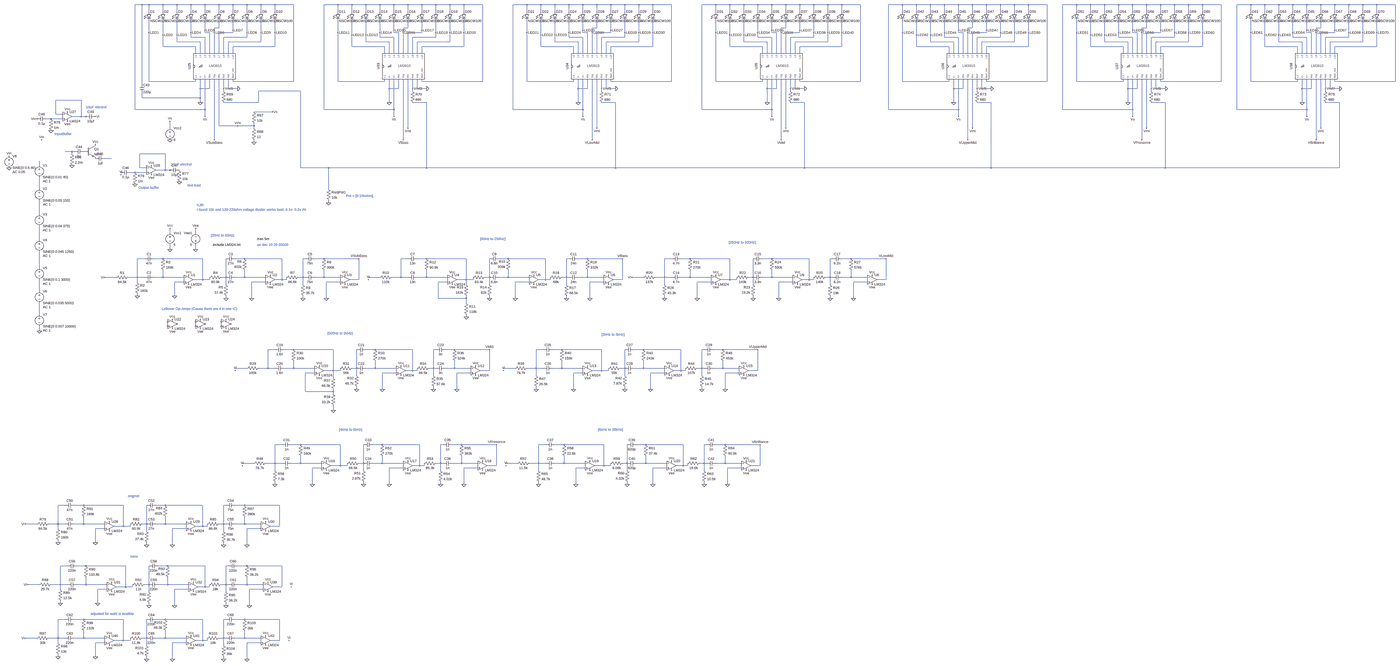
[diagram p0: schematic Full_Visualizer.asc, whole sheet]
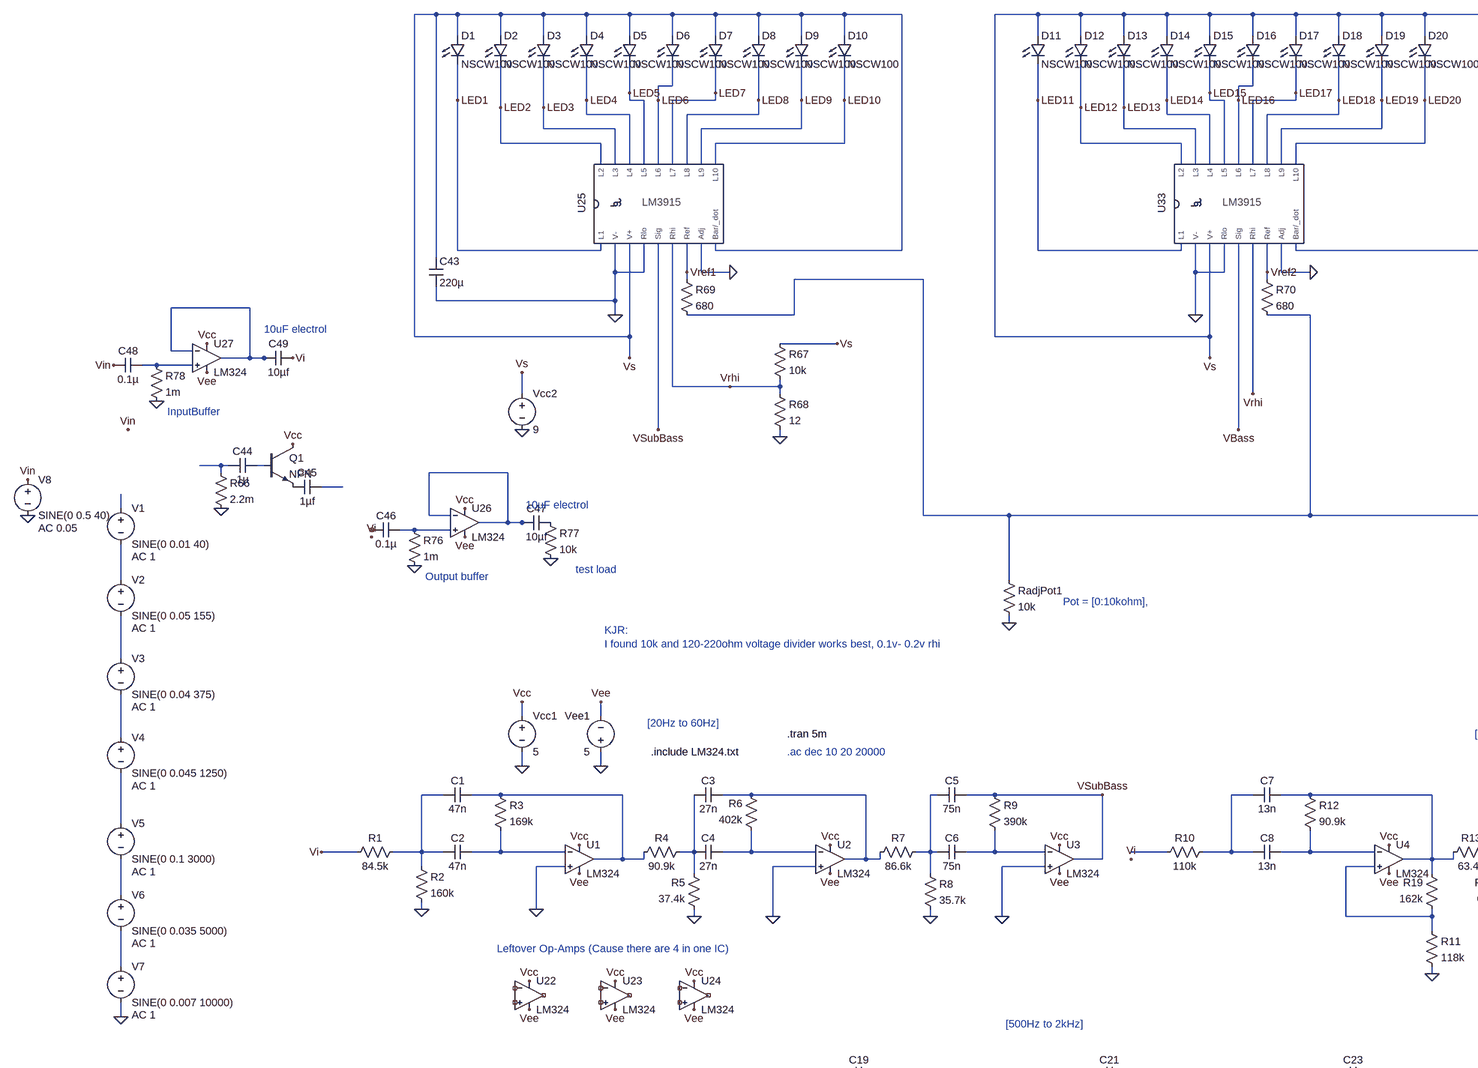
[diagram p1: schematic Full_Visualizer.asc, part, row 1 of 2, column 1 of 3]
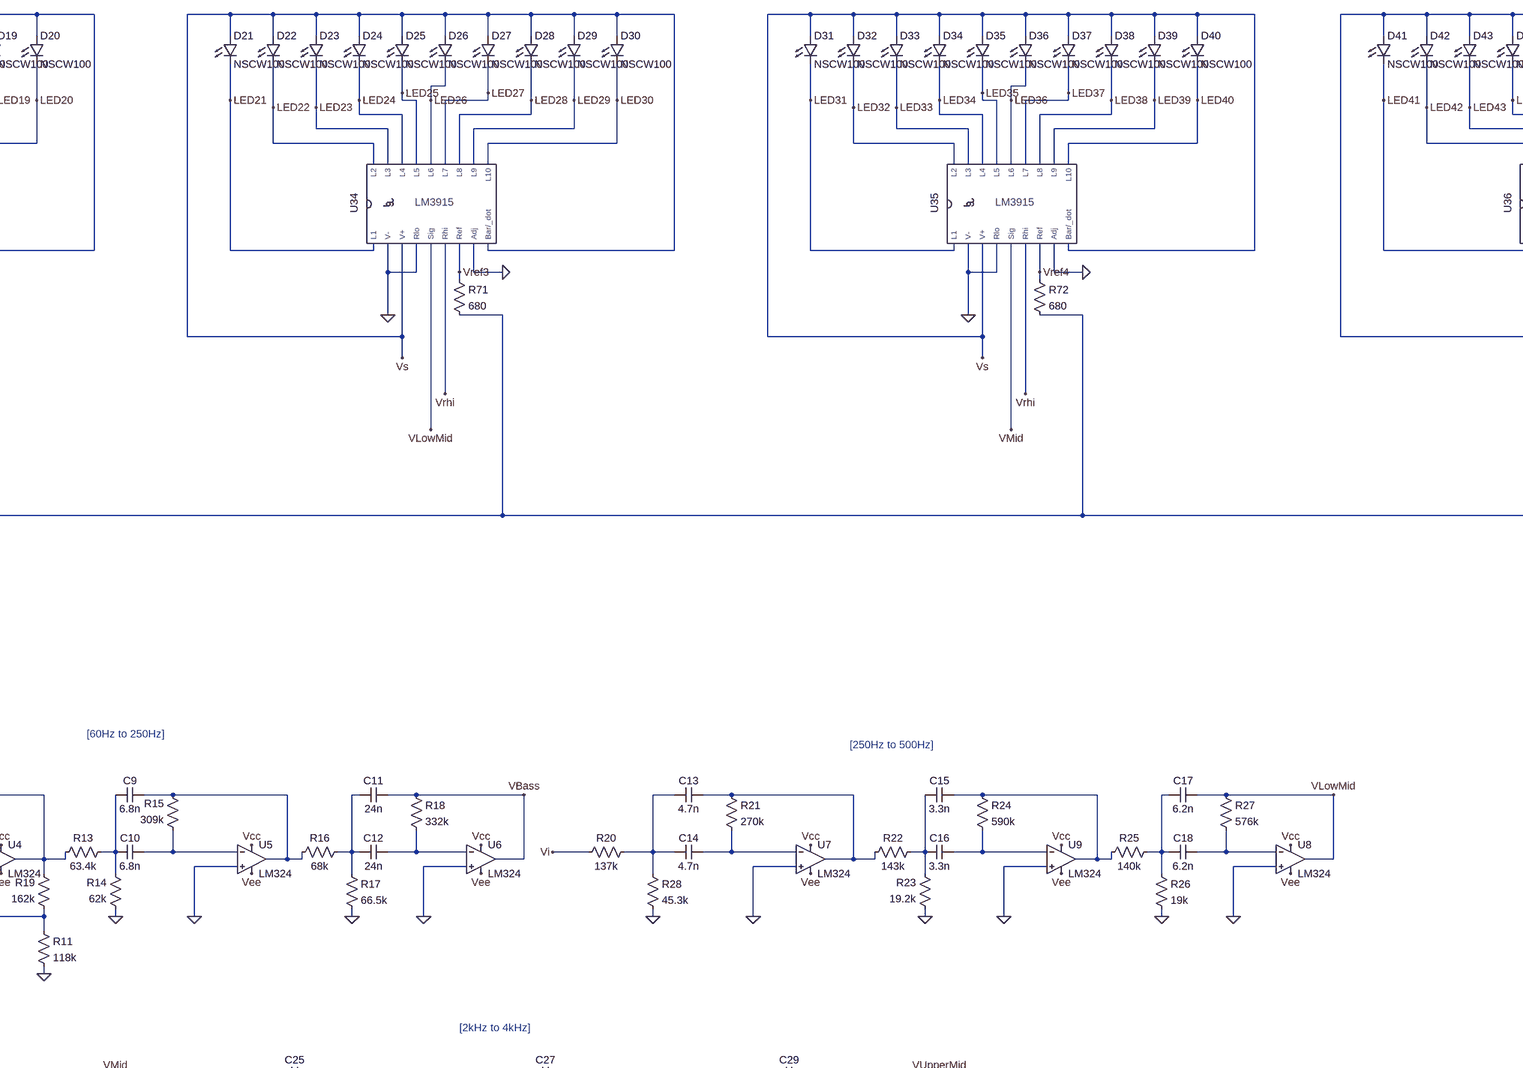
[diagram p2: schematic Full_Visualizer.asc, part, row 1 of 2, column 2 of 3]
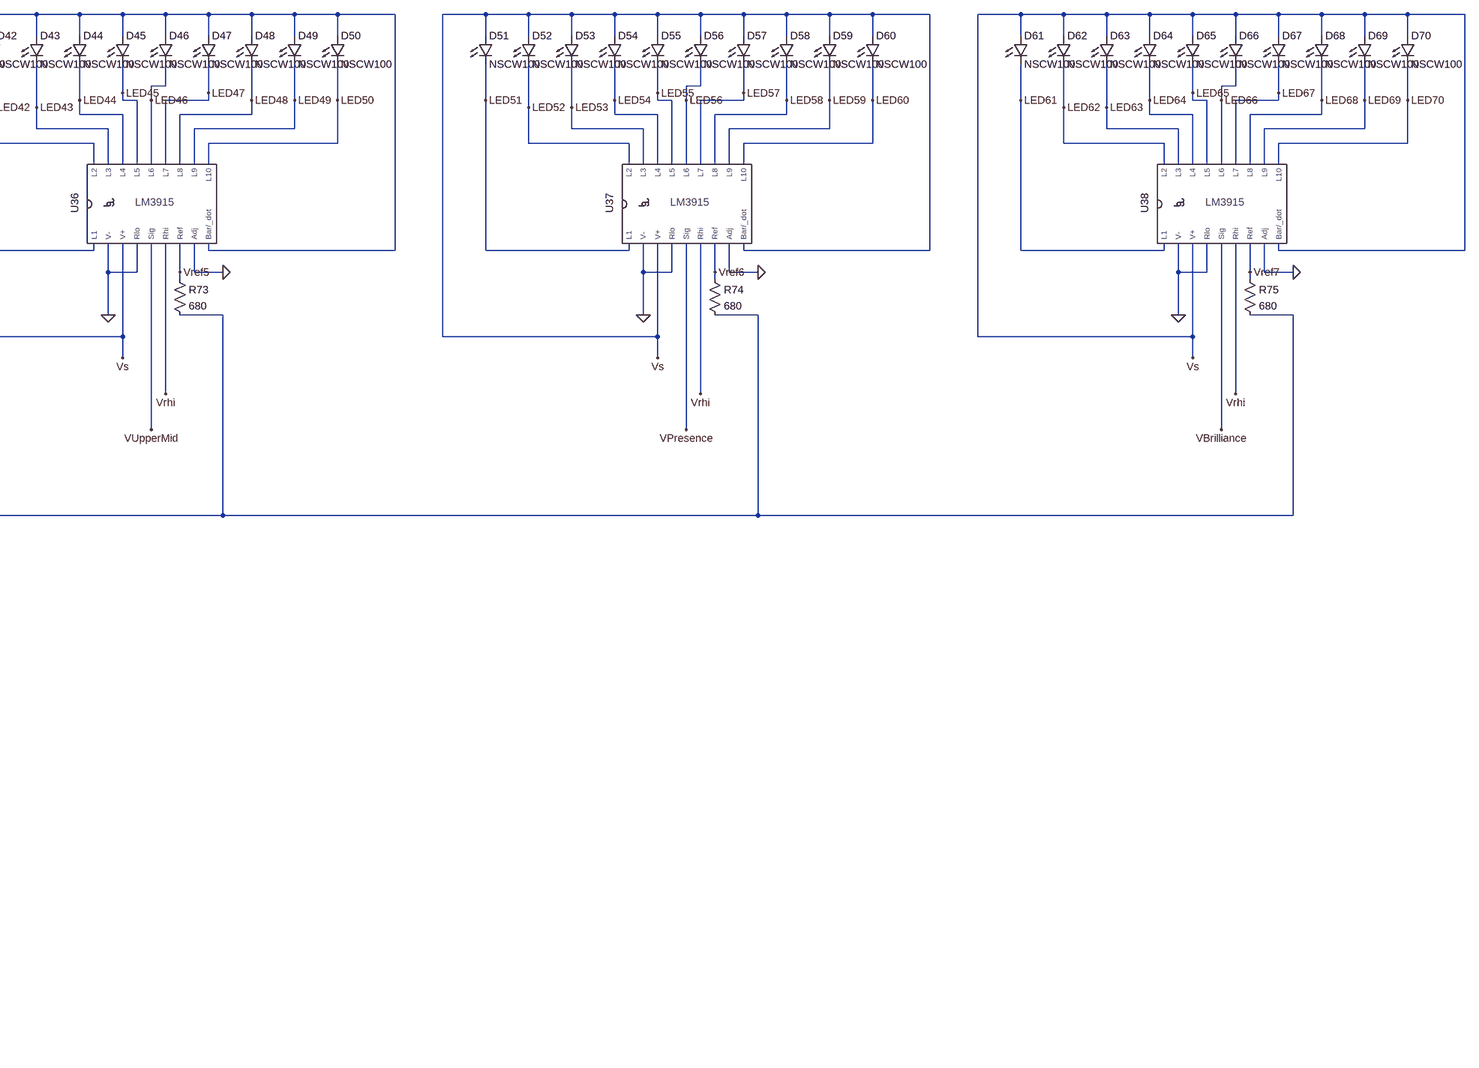
[diagram p3: schematic Full_Visualizer.asc, part, row 1 of 2, column 3 of 3]
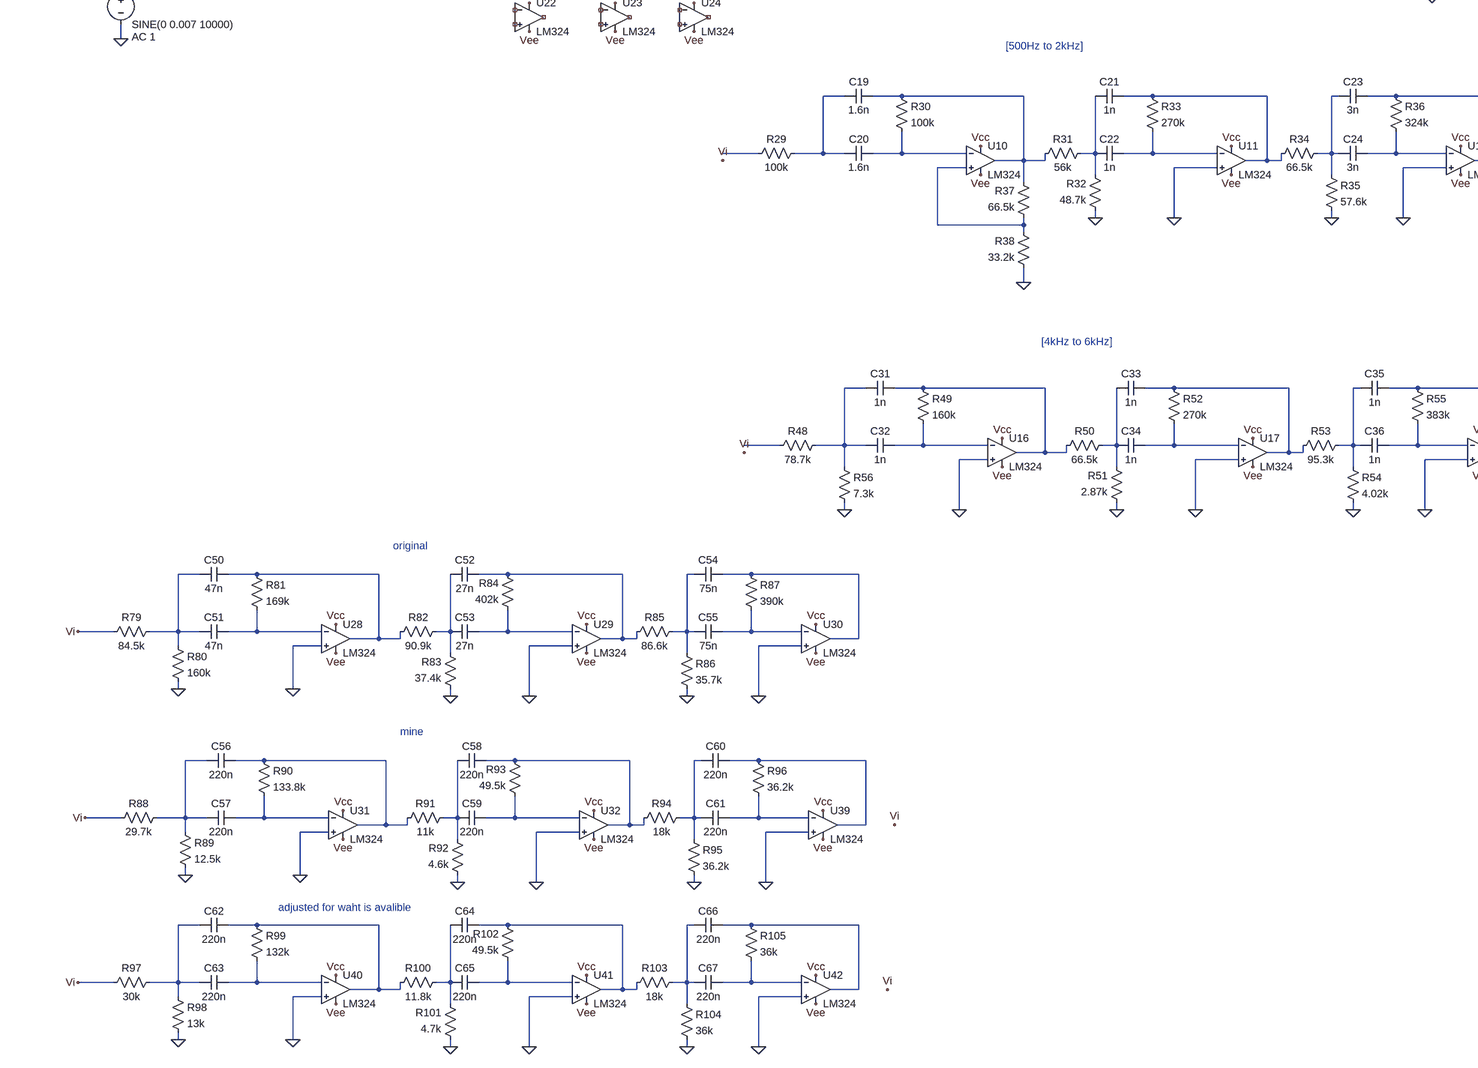
[diagram p4: schematic Full_Visualizer.asc, part, row 2 of 2, column 1 of 3]
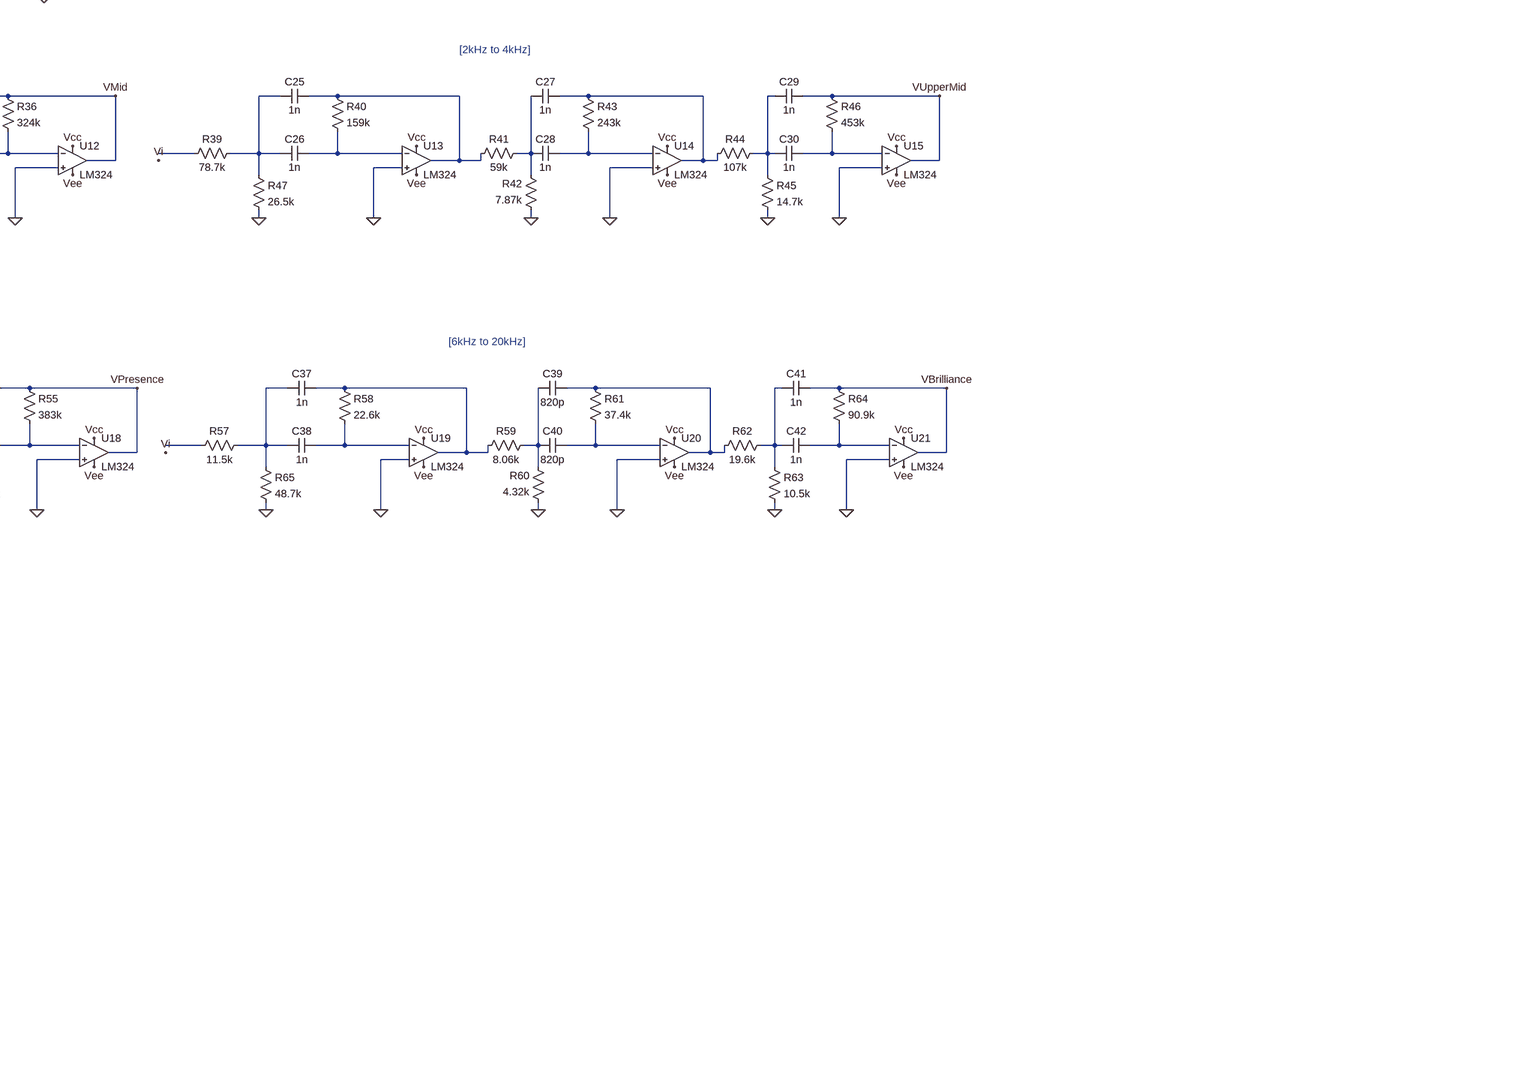
[diagram p5: schematic Full_Visualizer.asc, part, row 2 of 2, column 2 of 3]
* Full_Visualizer.asc
R1 N013 Vi 84.5k
V1 N008 N010 SINE(0 0.01 40) AC 1
R2 N013 0 160k
R3 N014 N026 169k
R4 N027 N014 90.9k
R5 0 N027 37.4k
R6 N028 N015 402k
R7 N015 N016 86.6k
R8 N016 0 35.7k
R9 VSubBass N029 390k
C1 N014 N013 47n
C2 N026 N013 47n
C3 N015 N027 27n
C4 N028 N027 27n
C5 VSubBass N016 75n
C6 N029 N016 75n
X§U1 0 N026 Vcc Vee N014 LM324  ; pins In+ In- V+ V- OUT
X§U2 0 N028 Vcc Vee N015 LM324  ; pins In+ In- V+ V- OUT
X§U3 0 N029 Vcc Vee VSubBass LM324  ; pins In+ In- V+ V- OUT
Vcc1 Vcc 0 5
Vee1 0 Vee 5
R10 N017 N030 110k
V2 N010 N011 SINE(0 0.05 155) AC 1
R11 N039 0 118k
R12 N018 N031 90.9k
R13 N032 N018 63.4k
R14 0 N032 62k
R15 N033 N019 309k
R16 N019 N020 68k
R17 N020 0 66.5k
R18 VBass N034 332k
C7 N018 N017 13n
C8 N031 N017 13n
C9 N019 N032 6.8n
C10 N033 N032 6.8n
C11 VBass N020 24n
C12 N034 N020 24n
R19 N039 N018 162k
X§U4 N039 N031 Vcc Vee N018 LM324  ; pins In+ In- V+ V- OUT
X§U5 0 N033 Vcc Vee N019 LM324  ; pins In+ In- V+ V- OUT
X§U6 0 N034 Vcc Vee VBass LM324  ; pins In+ In- V+ V- OUT
R20 N021 Vi 137k
V3 N011 N012 SINE(0 0.04 375) AC 1
R21 N022 N035 270k
R22 N036 N022 143k
R23 0 N036 19.2k
R24 N023 N037 590k
R25 N023 N024 140k
R26 N024 0 19k
R27 VLowMid N038 576k
C13 N022 N021 4.7n
C14 N035 N021 4.7n
C15 N023 N036 3.3n
C16 N037 N036 3.3n
C17 VLowMid N024 6.2n
C18 N038 N024 6.2n
R28 N021 0 45.3k
X§U7 0 N035 Vcc Vee N022 LM324  ; pins In+ In- V+ V- OUT
X§U8 0 N038 Vcc Vee VLowMid LM324  ; pins In+ In- V+ V- OUT
X§U9 0 N037 Vcc Vee N023 LM324  ; pins In+ In- V+ V- OUT
R29 N042 N050 100k
V4 N012 N025 SINE(0 0.045 1250) AC 1
R30 N043 N051 100k
R31 N052 N043 56k
R32 0 N052 48.7k
R33 N044 N053 270k
R34 N044 N045 66.5k
R35 N045 0 57.6k
R36 VMid N054 324k
C19 N043 N042 1.6n
C20 N051 N042 1.6n
C21 N044 N052 1n
C22 N053 N052 1n
C23 VMid N045 3n
C24 N054 N045 3n
R37 N060 N043 66.5k
R38 0 N060 33.2k
X§U10 N060 N051 Vcc Vee N043 LM324  ; pins In+ In- V+ V- OUT
X§U11 0 N053 Vcc Vee N044 LM324  ; pins In+ In- V+ V- OUT
X§U12 0 N054 Vcc Vee VMid LM324  ; pins In+ In- V+ V- OUT
R39 N046 N055 78.7k
V5 N025 N040 SINE(0 0.1 3000) AC 1
R40 N047 N056 159k
R41 N057 N047 59k
R42 0 N057 7.87k
R43 N048 N058 243k
R44 N048 N049 107k
R45 N049 0 14.7k
R46 VUpperMid N059 453k
C25 N047 N046 1n
C26 N056 N046 1n
C27 N048 N057 1n
C28 N058 N057 1n
C29 VUpperMid N049 1n
C30 N059 N049 1n
R47 N046 0 26.5k
X§U13 0 N056 Vcc Vee N047 LM324  ; pins In+ In- V+ V- OUT
X§U14 0 N058 Vcc Vee N048 LM324  ; pins In+ In- V+ V- OUT
X§U15 0 N059 Vcc Vee VUpperMid LM324  ; pins In+ In- V+ V- OUT
R48 N061 N069 78.7k
V6 N040 N041 SINE(0 0.035 5000) AC 1
R49 N062 N070 160k
R50 N071 N062 66.5k
R51 0 N071 2.87k
R52 N063 N072 270k
R53 N063 N064 95.3k
R54 N064 0 4.02k
R55 VPresence N073 383k
C31 N062 N061 1n
C32 N070 N061 1n
C33 N063 N071 1n
C34 N072 N071 1n
C35 VPresence N064 1n
C36 N073 N064 1n
R56 N061 0 7.3k
X§U16 0 N070 Vcc Vee N062 LM324  ; pins In+ In- V+ V- OUT
X§U17 0 N072 Vcc Vee N063 LM324  ; pins In+ In- V+ V- OUT
X§U18 0 N073 Vcc Vee VPresence LM324  ; pins In+ In- V+ V- OUT
R57 N065 N074 11.5k
V7 N041 0 SINE(0 0.007 10000) AC 1
R58 N066 N075 22.6k
R59 N076 N066 8.06k
R60 0 N076 4.32k
R61 N067 N077 37.4k
R62 N067 N068 19.6k
R63 N068 0 10.5k
R64 VBrilliance N078 90.9k
C37 N066 N065 1n
C38 N075 N065 1n
C39 N067 N076 820p
C40 N077 N076 820p
C41 VBrilliance N068 1n
C42 N078 N068 1n
R65 N065 0 48.7k
X§U19 0 N075 Vcc Vee N066 LM324  ; pins In+ In- V+ V- OUT
X§U20 0 N077 Vcc Vee N067 LM324  ; pins In+ In- V+ V- OUT
X§U21 0 N078 Vcc Vee VBrilliance LM324  ; pins In+ In- V+ V- OUT
X§U22 NC_01 NC_02 Vcc Vee NC_03 LM324  ; pins In+ In- V+ V- OUT
X§U23 NC_04 NC_05 Vcc Vee NC_06 LM324  ; pins In+ In- V+ V- OUT
X§U24 NC_07 NC_08 Vcc Vee NC_09 LM324  ; pins In+ In- V+ V- OUT
D1 Vs LED1 NSCW100
D2 Vs LED2 NSCW100
D3 Vs LED3 NSCW100
D4 Vs LED4 NSCW100
D5 Vs LED5 NSCW100
D6 Vs LED6 NSCW100
D7 Vs LED7 NSCW100
D8 Vs LED8 NSCW100
D9 Vs LED9 NSCW100
D10 Vs LED10 NSCW100
C43 Vs 0 220µ
Vcc2 Vs 0 9
R67 Vs Vrhi 10k
R68 Vrhi 0 12
R69 Vref1 N001 680
D12 Vs LED12 NSCW100
D13 Vs LED13 NSCW100
D14 Vs LED14 NSCW100
D15 Vs LED15 NSCW100
D16 Vs LED16 NSCW100
D17 Vs LED17 NSCW100
D18 Vs LED18 NSCW100
D19 Vs LED19 NSCW100
D20 Vs LED20 NSCW100
R70 Vref2 N001 680
D22 Vs LED22 NSCW100
D23 Vs LED23 NSCW100
D24 Vs LED24 NSCW100
D25 Vs LED25 NSCW100
D26 Vs LED26 NSCW100
D27 Vs LED27 NSCW100
D28 Vs LED28 NSCW100
D29 Vs LED29 NSCW100
D30 Vs LED30 NSCW100
R71 Vref3 N001 680
D32 Vs LED32 NSCW100
D33 Vs LED33 NSCW100
D34 Vs LED34 NSCW100
D35 Vs LED35 NSCW100
D36 Vs LED36 NSCW100
D37 Vs LED37 NSCW100
D38 Vs LED38 NSCW100
D39 Vs LED39 NSCW100
D40 Vs LED40 NSCW100
R72 Vref4 N001 680
D42 Vs LED42 NSCW100
D43 Vs LED43 NSCW100
D44 Vs LED44 NSCW100
D45 Vs LED45 NSCW100
D46 Vs LED46 NSCW100
D47 Vs LED47 NSCW100
D48 Vs LED48 NSCW100
D49 Vs LED49 NSCW100
D50 Vs LED50 NSCW100
R73 Vref5 N001 680
D52 Vs LED52 NSCW100
D53 Vs LED53 NSCW100
D54 Vs LED54 NSCW100
D55 Vs LED55 NSCW100
D56 Vs LED56 NSCW100
D57 Vs LED57 NSCW100
D58 Vs LED58 NSCW100
D59 Vs LED59 NSCW100
D60 Vs LED60 NSCW100
R74 Vref6 N001 680
D62 Vs LED62 NSCW100
D63 Vs LED63 NSCW100
D64 Vs LED64 NSCW100
D65 Vs LED65 NSCW100
D66 Vs LED66 NSCW100
D67 Vs LED67 NSCW100
D68 Vs LED68 NSCW100
D69 Vs LED69 NSCW100
D70 Vs LED70 NSCW100
R75 Vref7 N001 680
RadjPot1 N001 0 10k
D11 Vs LED11 NSCW100
D21 Vs LED21 NSCW100
D31 Vs LED31 NSCW100
D41 Vs LED41 NSCW100
D51 Vs LED51 NSCW100
D61 Vs LED61 NSCW100
X§U25 Vs Vrhi VSubBass Vs 0 0 LED1 LED10 LED2 LED3 LED4 LED5 LED6 LED7 LED8 LED9 Vref1 0 LM3915  ; pins Bar/_dot Rhi Sig V+ V- Adj L1 L10 L2 L3 L4 L5 L6 L7 L8 L9 Ref Rlo
X§U33 Vs Vrhi VBass Vs 0 0 LED11 LED20 LED12 LED13 LED14 LED15 LED16 LED17 LED18 LED19 Vref2 0 LM3915  ; pins Bar/_dot Rhi Sig V+ V- Adj L1 L10 L2 L3 L4 L5 L6 L7 L8 L9 Ref Rlo
X§U34 Vs Vrhi VLowMid Vs 0 0 LED21 LED30 LED22 LED23 LED24 LED25 LED26 LED27 LED28 LED29 Vref3 0 LM3915  ; pins Bar/_dot Rhi Sig V+ V- Adj L1 L10 L2 L3 L4 L5 L6 L7 L8 L9 Ref Rlo
X§U35 Vs Vrhi VMid Vs 0 0 LED31 LED40 LED32 LED33 LED34 LED35 LED36 LED37 LED38 LED39 Vref4 0 LM3915  ; pins Bar/_dot Rhi Sig V+ V- Adj L1 L10 L2 L3 L4 L5 L6 L7 L8 L9 Ref Rlo
X§U36 Vs Vrhi VUpperMid Vs 0 0 LED41 LED50 LED42 LED43 LED44 LED45 LED46 LED47 LED48 LED49 Vref5 0 LM3915  ; pins Bar/_dot Rhi Sig V+ V- Adj L1 L10 L2 L3 L4 L5 L6 L7 L8 L9 Ref Rlo
X§U37 Vs Vrhi VPresence Vs 0 0 LED51 LED60 LED52 LED53 LED54 LED55 LED56 LED57 LED58 LED59 Vref6 0 LM3915  ; pins Bar/_dot Rhi Sig V+ V- Adj L1 L10 L2 L3 L4 L5 L6 L7 L8 L9 Ref Rlo
X§U38 Vs Vrhi VBrilliance Vs 0 0 LED61 LED70 LED62 LED63 LED64 LED65 LED66 LED67 LED68 LED69 Vref7 0 LM3915  ; pins Bar/_dot Rhi Sig V+ V- Adj L1 L10 L2 L3 L4 L5 L6 L7 L8 L9 Ref Rlo
V8 Vin 0 SINE(0 0.5 40) AC 0.05
Q1 Vcc N005 P001 0 NPN
R66 N004 0 2.2m
C44 N005 N004 1µ
C45 N007 P001 1µf
X§U26 N009 N006 Vcc Vee N006 LM324  ; pins In+ In- V+ V- OUT
R76 N009 0 1m
C46 N009 NC_10 0.1µ
C47 P002 N006 10µf
R77 P002 0 10k
X§U27 N003 N002 Vcc Vee N002 LM324  ; pins In+ In- V+ V- OUT
R78 N003 0 1m
C48 N003 Vin 0.1µ
C49 Vi N002 10µf
R79 N079 Vi 84.5k
R80 N079 0 160k
R81 N080 N084 169k
R82 N085 N080 90.9k
R83 0 N085 37.4k
R84 N086 N081 402k
R85 N081 N082 86.6k
R86 N082 0 35.7k
R87 N083 N087 390k
C50 N080 N079 47n
C51 N084 N079 47n
C52 N081 N085 27n
C53 N086 N085 27n
C54 N083 N082 75n
C55 N087 N082 75n
X§U28 0 N084 Vcc Vee N080 LM324  ; pins In+ In- V+ V- OUT
X§U29 0 N086 Vcc Vee N081 LM324  ; pins In+ In- V+ V- OUT
X§U30 0 N087 Vcc Vee N083 LM324  ; pins In+ In- V+ V- OUT
R88 N088 Vi 29.7k
R89 N088 0 12.5k
R90 N089 N093 133.8k
R91 N094 N089 11k
R92 0 N094 4.6k
R93 N095 N090 49.5k
R94 N090 N091 18k
R95 N091 0 36.2k
R96 N092 N096 36.2k
C56 N089 N088 220n
C57 N093 N088 220n
C58 N090 N094 220n
C59 N095 N094 220n
C60 N092 N091 220n
C61 N096 N091 220n
X§U31 0 N093 Vcc Vee N089 LM324  ; pins In+ In- V+ V- OUT
X§U32 0 N095 Vcc Vee N090 LM324  ; pins In+ In- V+ V- OUT
X§U39 0 N096 Vcc Vee N092 LM324  ; pins In+ In- V+ V- OUT
R97 N097 Vi 30k
R98 N097 0 13k
R99 N098 N102 132k
R100 N103 N098 11.8k
R101 0 N103 4.7k
R102 N104 N099 49.5k
R103 N099 N100 18k
R104 N100 0 36k
R105 N101 N105 36k
C62 N098 N097 220n
C63 N102 N097 220n
C64 N099 N103 220n
C65 N104 N103 220n
C66 N101 N100 220n
C67 N105 N100 220n
X§U40 0 N102 Vcc Vee N098 LM324  ; pins In+ In- V+ V- OUT
X§U41 0 N104 Vcc Vee N099 LM324  ; pins In+ In- V+ V- OUT
X§U42 0 N105 Vcc Vee N101 LM324  ; pins In+ In- V+ V- OUT
.model D D
.lib standard.dio
.model NPN NPN
.model PNP PNP
.lib standard.bjt
.tran 5m
* .ac dec 10 20 20000
* [20Hz to 60Hz]
.include LM324.txt
* [60Hz to 250Hz]
* [250Hz to 500Hz]
* [500Hz to 2kHz]
* [2kHz to 4kHz]
* [4kHz to 6kHz]
* [6kHz to 20kHz]
* Leftover Op-Amps (Cause there are 4 in one IC)
* Pot = [0:10kohm],
* 10uF electrol
* Output buffer
* test load
* 10uF electrol
* InputBuffer
* original
* mine
* adjusted for waht is avalible
* KJR:
* I found 10k and 120-220ohm voltage divider works best, 0.1v- 0.2v rhi
.lib LM3915.sub
.backanno
.end